# EAGLE schematic Transceiver 1.0 (EAGLE 9.6.2)
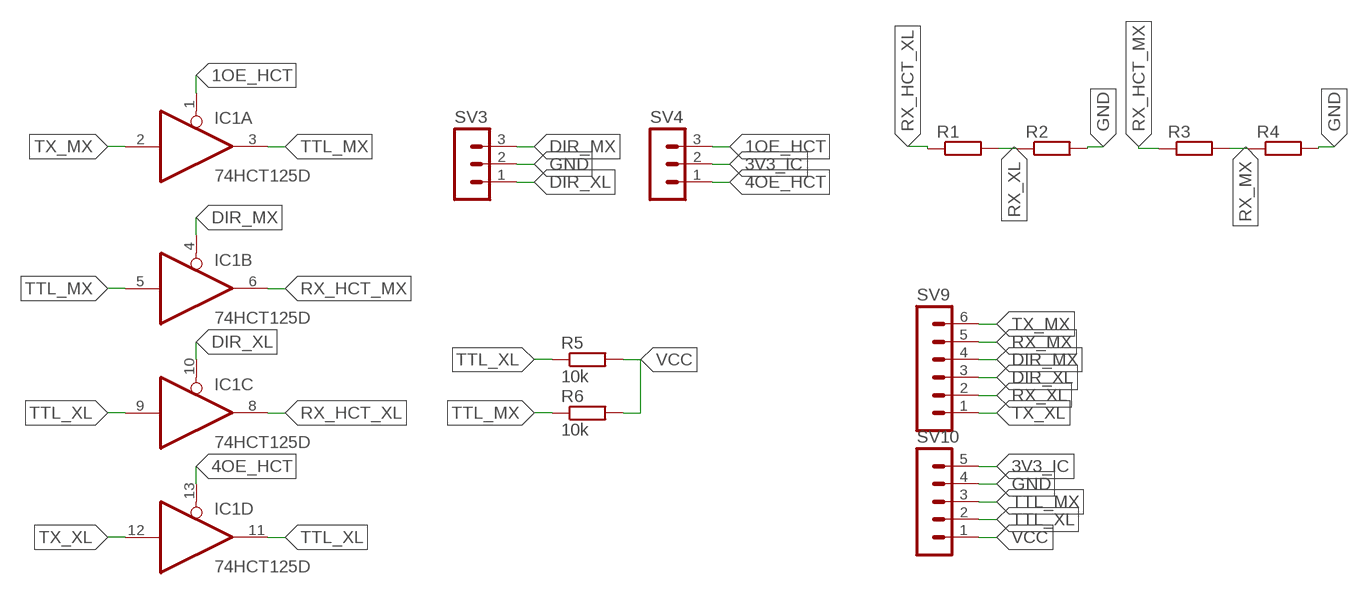
[diagram p0: schematic, sheet 1]

## Parts
IC1  74HCT125D  [SO14]
R1  R-EU_R1206  [R1206]
R2  R-EU_R1206  [R1206]
R3  R-EU_R1206  [R1206]
R4  R-EU_R1206  [R1206]
R5  10k  R-EU_R1206  [R1206]
R6  10k  R-EU_R1206  [R1206]
SV3  MA03-1  [MA03-1]
SV4  MA03-1  [MA03-1]
SV9  MA06-1  [MA06-1]
SV10  MA05-1  [MA05-1]

## Nets
1OE_HCT: IC1.1(A:OE) SV4.3
3V3_IC: SV4.2 SV10.5
4OE_HCT: IC1.13(D:OE) SV4.1
DIR_MX: IC1.4(B:OE) SV3.3 SV9.4
DIR_XL: IC1.10(C:OE) SV3.1 SV9.3
GND: R2.2 R4.2 SV3.2 SV10.4
RX_HCT_MX: IC1.6(B:O) R3.1
RX_HCT_XL: IC1.8(C:O) R1.1
RX_MX: R3.2 R4.1 SV9.5
RX_XL: R1.2 R2.1 SV9.2
TTL_MX: IC1.3(A:O) IC1.5(B:I) R6.1 SV10.3
TTL_XL: IC1.9(C:I) IC1.11(D:O) R5.1 SV10.2
TX_MX: IC1.2(A:I) SV9.6
TX_XL: IC1.12(D:I) SV9.1
VCC: R5.2 R6.2 SV10.1

## Power pins joined to a net without a drawn wire
GND: IC1.7(P:GND)
VCC: IC1.14(P:VCC)

## Library data of the parts
IC1 = 74xx-eu:74*125: Quad bus BUFFER, 3-state
R1-R6 = resistor:R-EU_: RESISTOR, European symbol
SV3 SV4 = con-lstb:MA03-1: PIN HEADER; OC_FARNELL: unknown; OC_NEWARK: unknown
SV9 = con-lstb:MA06-1: PIN HEADER; OC_FARNELL: unknown; OC_NEWARK: unknown
SV10 = con-lstb:MA05-1: PIN HEADER; OC_FARNELL: unknown; OC_NEWARK: unknown